# EAGLE design dumbpad (EAGLE 9.6.1)
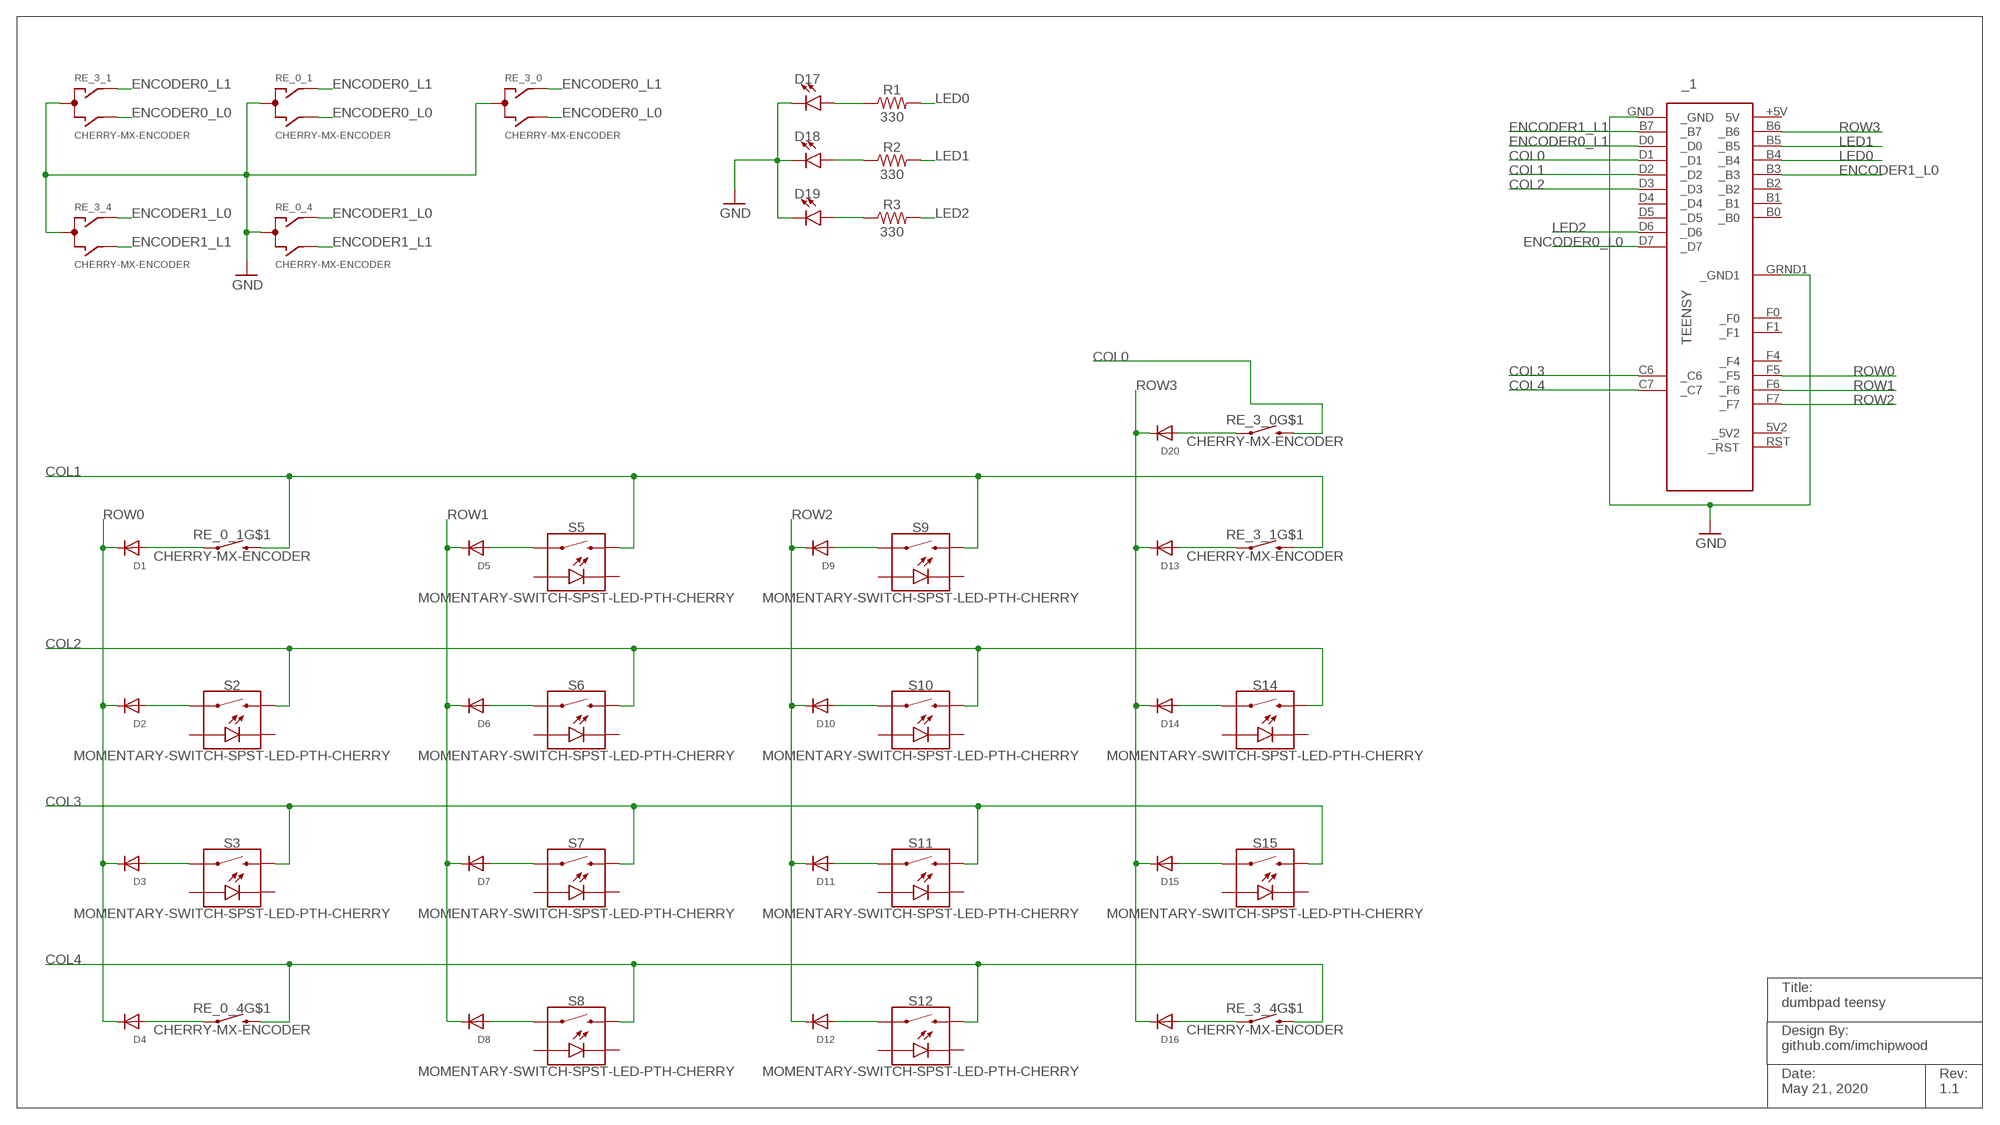
[diagram p0: schematic, sheet 1]

## Parts
_1  TEENSY  [TEENSY]
D1  DIODEDO-1N4148  [DO-1N4148]
D2  DIODEDO-1N4148  [DO-1N4148]
D3  DIODEDO-1N4148  [DO-1N4148]
D4  DIODEDO-1N4148  [DO-1N4148]
D5  DIODEDO-1N4148  [DO-1N4148]
D6  DIODEDO-1N4148  [DO-1N4148]
D7  DIODEDO-1N4148  [DO-1N4148]
D8  DIODEDO-1N4148  [DO-1N4148]
D9  DIODEDO-1N4148  [DO-1N4148]
D10  DIODEDO-1N4148  [DO-1N4148]
D11  DIODEDO-1N4148  [DO-1N4148]
D12  DIODEDO-1N4148  [DO-1N4148]
D13  DIODEDO-1N4148  [DO-1N4148]
D14  DIODEDO-1N4148  [DO-1N4148]
D15  DIODEDO-1N4148  [DO-1N4148]
D16  DIODEDO-1N4148  [DO-1N4148]
D17  LED3MM  [LED_3MM]
D18  LED3MM  [LED_3MM]
D19  LED3MM  [LED_3MM]
D20  DIODEDO-1N4148  [DO-1N4148]
R1  330  330OHM-HORIZ-1/10W-5%  [AXIAL-0.3]
R2  330  330OHM-HORIZ-1/10W-5%  [AXIAL-0.3]
R3  330  330OHM-HORIZ-1/10W-5%  [AXIAL-0.3]
RE_0_1  CHERRY-MX-ENCODER  [CHERRY-MX-ENCODER]
RE_0_4  CHERRY-MX-ENCODER  [CHERRY-MX-ENCODER]
RE_3_0  CHERRY-MX-ENCODER  [CHERRY-MX-ENCODER]
RE_3_1  CHERRY-MX-ENCODER  [CHERRY-MX-ENCODER]
RE_3_4  CHERRY-MX-ENCODER  [CHERRY-MX-ENCODER]
S2  MOMENTARY-SWITCH-SPST-LED-PTH-CHERRY  [CHERRY-MX-LED]
S3  MOMENTARY-SWITCH-SPST-LED-PTH-CHERRY  [CHERRY-MX-LED]
S5  MOMENTARY-SWITCH-SPST-LED-PTH-CHERRY  [CHERRY-MX-LED]
S6  MOMENTARY-SWITCH-SPST-LED-PTH-CHERRY  [CHERRY-MX-LED]
S7  MOMENTARY-SWITCH-SPST-LED-PTH-CHERRY  [CHERRY-MX-LED]
S8  MOMENTARY-SWITCH-SPST-LED-PTH-CHERRY  [CHERRY-MX-LED]
S9  MOMENTARY-SWITCH-SPST-LED-PTH-CHERRY  [CHERRY-MX-LED]
S10  MOMENTARY-SWITCH-SPST-LED-PTH-CHERRY  [CHERRY-MX-LED]
S11  MOMENTARY-SWITCH-SPST-LED-PTH-CHERRY  [CHERRY-MX-LED]
S12  MOMENTARY-SWITCH-SPST-LED-PTH-CHERRY  [CHERRY-MX-LED]
S14  MOMENTARY-SWITCH-SPST-LED-PTH-CHERRY  [CHERRY-MX-LED]
S15  MOMENTARY-SWITCH-SPST-LED-PTH-CHERRY  [CHERRY-MX-LED]

## Nets
COL0: _1.D1(_D1) RE_3_0.E RE_3_0.S2
COL1: _1.D2(_D2) RE_0_1.E RE_0_1.S2 RE_3_1.E RE_3_1.S2 S5.S2 S9.S2
COL2: _1.D3(_D3) S2.S2 S6.S2 S10.S2 S14.S2
COL3: _1.C6(_C6) S3.S2 S7.S2 S11.S2 S15.S2
COL4: _1.C7(_C7) RE_0_4.E RE_0_4.S2 RE_3_4.E RE_3_4.S2 S8.S2 S12.S2
ENCODER0_L0: _1.D7(_D7) RE_0_1.B RE_3_0.B RE_3_1.B
ENCODER0_L1: _1.D0(_D0) RE_0_1.A RE_3_0.A RE_3_1.A
ENCODER1_L0: _1.B3(_B3) RE_0_4.A RE_3_4.A
ENCODER1_L1: _1.B7(_B7) RE_0_4.B RE_3_4.B
GND: _1.GND(_GND) _1.GRND1(_GND1) D17.K(C) D18.K(C) D19.K(C) RE_0_1.C RE_0_4.C RE_3_0.C RE_3_1.C RE_3_4.C
LED0: _1.B4(_B4) R1.P$2
LED1: _1.B5(_B5) R2.P$2
LED2: _1.D6(_D6) R3.P$2
N$1: D4.A RE_0_4.D RE_0_4.S1
N$2: D3.A S3.S1
N$3: D2.A S2.S1
N$4: D1.A RE_0_1.D RE_0_1.S1
N$5: D17.A R1.P$1
N$6: D8.A S8.S1
N$7: D7.A S7.S1
N$8: D6.A S6.S1
N$9: D5.A S5.S1
N$10: D18.A R2.P$1
N$11: D16.A RE_3_4.D RE_3_4.S1
N$12: D15.A S15.S1
N$13: D14.A S14.S1
N$14: D13.A RE_3_1.D RE_3_1.S1
N$15: D19.A R3.P$1
N$16: D12.A S12.S1
N$17: D11.A S11.S1
N$18: D10.A S10.S1
N$19: D9.A S9.S1
N$20: D20.A RE_3_0.D RE_3_0.S1
ROW0: _1.F5(_F5) D1.C D2.C D3.C D4.C
ROW1: _1.F6(_F6) D5.C D6.C D7.C D8.C
ROW2: _1.F7(_F7) D9.C D10.C D11.C D12.C
ROW3: _1.B6(_B6) D13.C D14.C D15.C D16.C D20.C
Unconnected: _1.5V2(_5V2) _1.+5V(5V) _1.B0(_B0) _1.B1(_B1) _1.B2(_B2) _1.D4(_D4) _1.D5(_D5) _1.F0(_F0) _1.F1(_F1) _1.F4(_F4) _1.RST(_RST) S2.A S2.K(C) S3.A S3.K(C) S5.A S5.K(C) S6.A S6.K(C) S7.A S7.K(C) S8.A S8.K(C) S9.A S9.K(C) S10.A S10.K(C) S11.A S11.K(C) S12.A S12.K(C) S14.A S14.K(C) S15.A S15.K(C)

## Notes on the sheet
- Title:
  dumbpad teensy
- Design By:
  github.com/imchipwood
- Date:
  May 21, 2020
- Rev:
  1.1

## Library data of the parts
_1 = cpwood:TEENSY: Teensy 2.0
D1-D16 D20 = adafruit:DIODE: Diode SMADIODE - SMA Surface Mount Package 20V 1A Schottky Diode Digikey: 641-1014-6-ND DO-1N4148 - Through Hole Small Current Diode SOD-123 20V 1 A (.5mV Vf) Schottky Diode - Digikey: MBRX120TPMSCT-ND SOD-323 10V 570mA (.38mV Vf, 3ns) Schottky Diode - Digikey: ZLLS410CT-ND SOD-523 30V 30mA Schottky Diode (RB751S-40TE61) - Digikey: RB751S-40TE61CT-ND SOT23-R/W - SOT23 Package (R = Solder Paste/Reflow Ovens, W = Hand-Soldering) BAT54Film 40V 300mA - Digikey: 497-7162-1-ND
D17-D19 = SparkFun-LED:LED: LED (Generic) Standard schematic elements and footprints for 5mm, 3mm, 1206, and 0603 sized LEDs. Generic LEDs with no color specified.; PROD_ID: DIO-08794
R1-R3 = SparkFun-Resistors:330OHM: 330Ω resistor A resistor is a passive two-terminal electrical component that implements electrical resistance as a circuit element. Resistors act to reduce current flow, and, at the same time, act to lower voltage levels within circuits. - Wikipedia; PROD_ID: RES-8371
RE_0_1 RE_0_4 RE_3_0 RE_3_1 RE_3_4 = cpwood:CHERRY-MX-ENCODER
S2 S3 S5-S12 S14 S15 = SparkFun-Switches:MOMENTARY-SWITCH-SPST-LED: Momentary Switch (Pushbutton) - SPST - w/ LED Normally-open (NO) SPST momentary switches (buttons, pushbuttons), with a built-in LED. Variants PTH-CHERRY - Cherry MX Switch Cherry MX Keyswitches are top-of-the-line mechanical keyboard switches. They’re satisfyingly “clicky”, reliable up to tens-of-millions of key presses, and a standard in gaming and programming keyboards across the globe. This ‘blue’ version Cherry MX Switch is favored by most due to its secondary internal actuator making it less likely to “double-tap.” If you are looking for a noticeably audible and high-quality key switch, this is the perfect option for you! Cherry MX Switch <https://www.sparkfun.com/products/13834> (COM-13834) Cherry MX Switch Breakout <https://www.sparkfun.com/products/13773> (BOB-13773) PTH-12MM and PTH-12MM-KIT - 12mm Illuminated LED KIT variant is for soldering kits. There is no tStop (covering up the top side of the pads with mask). This helps the beginner see which side they should be soldering too. LED Tactile Button Breakout <https://www.sparkfun.com/products/10467> (BOB-10467) LED Tactile Button - Red <https://www.sparkfun.com/products/10442> (COM-10442) LED Tactile Button - Blue <https://www.sparkfun.com/products/10443> (COM-10443) LED Tactile Button - Green <https://www.sparkfun.com/products/10440> (COM-10440) LED Tactile Button - Orange <https://www.sparkfun.com/products/10441> (COM-10441) LED Tactile Button - White <https://www.sparkfun.com/products/10439> (COM-10439); SF_ID: COM-13834

## Board
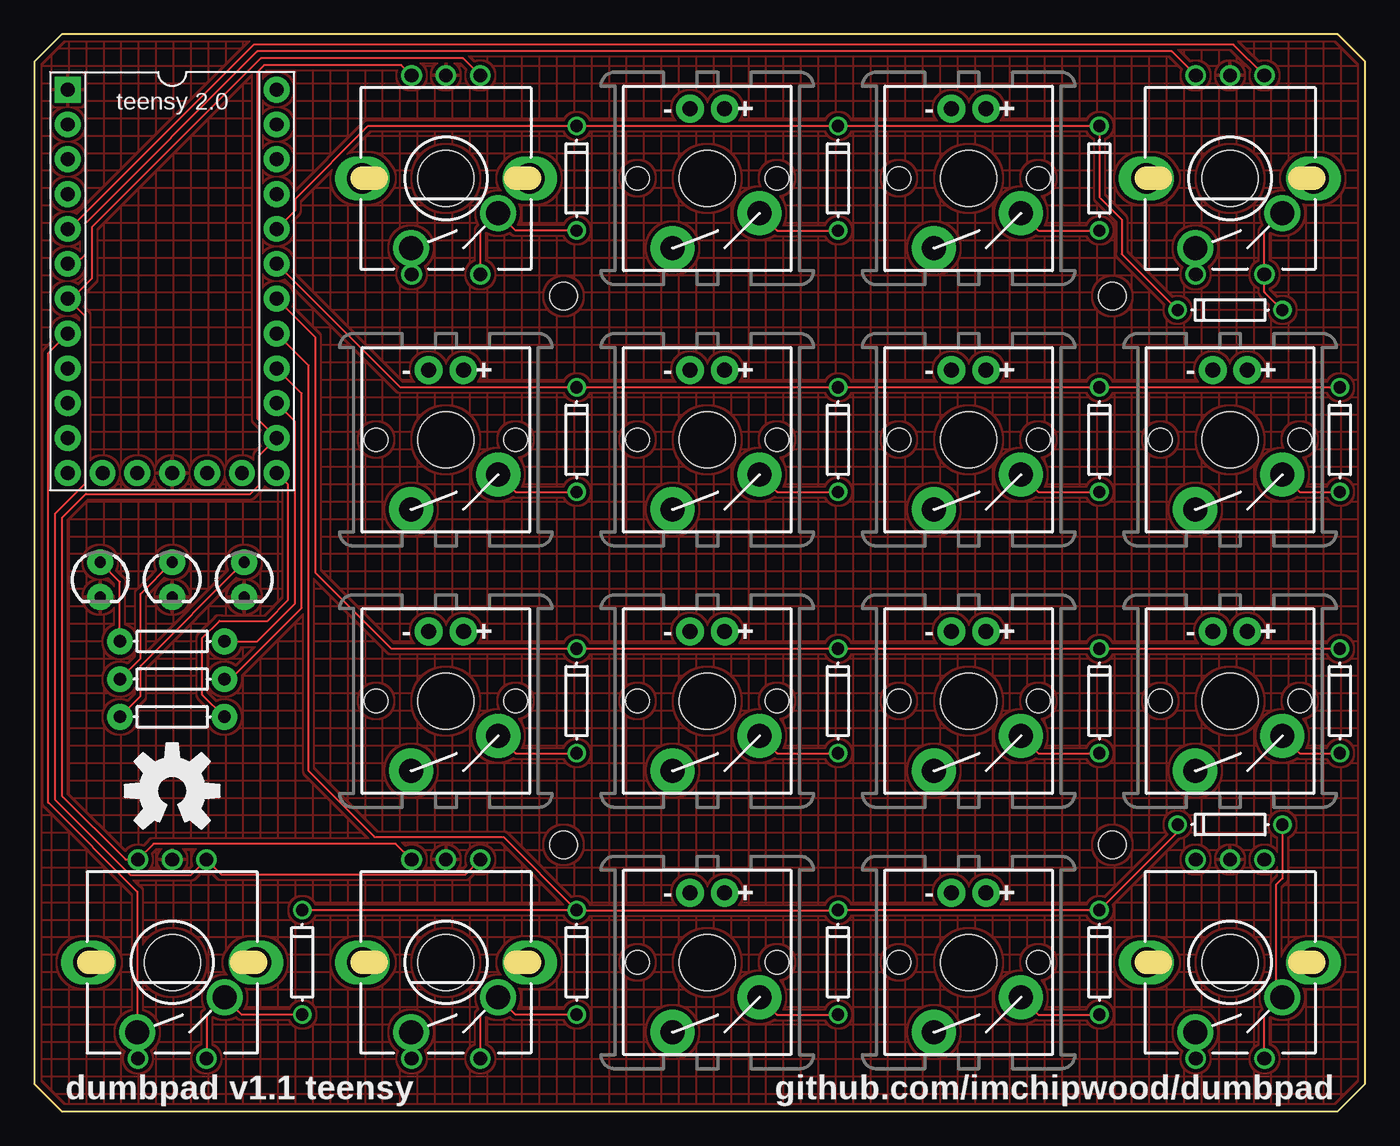
[diagram p1: board, top side]
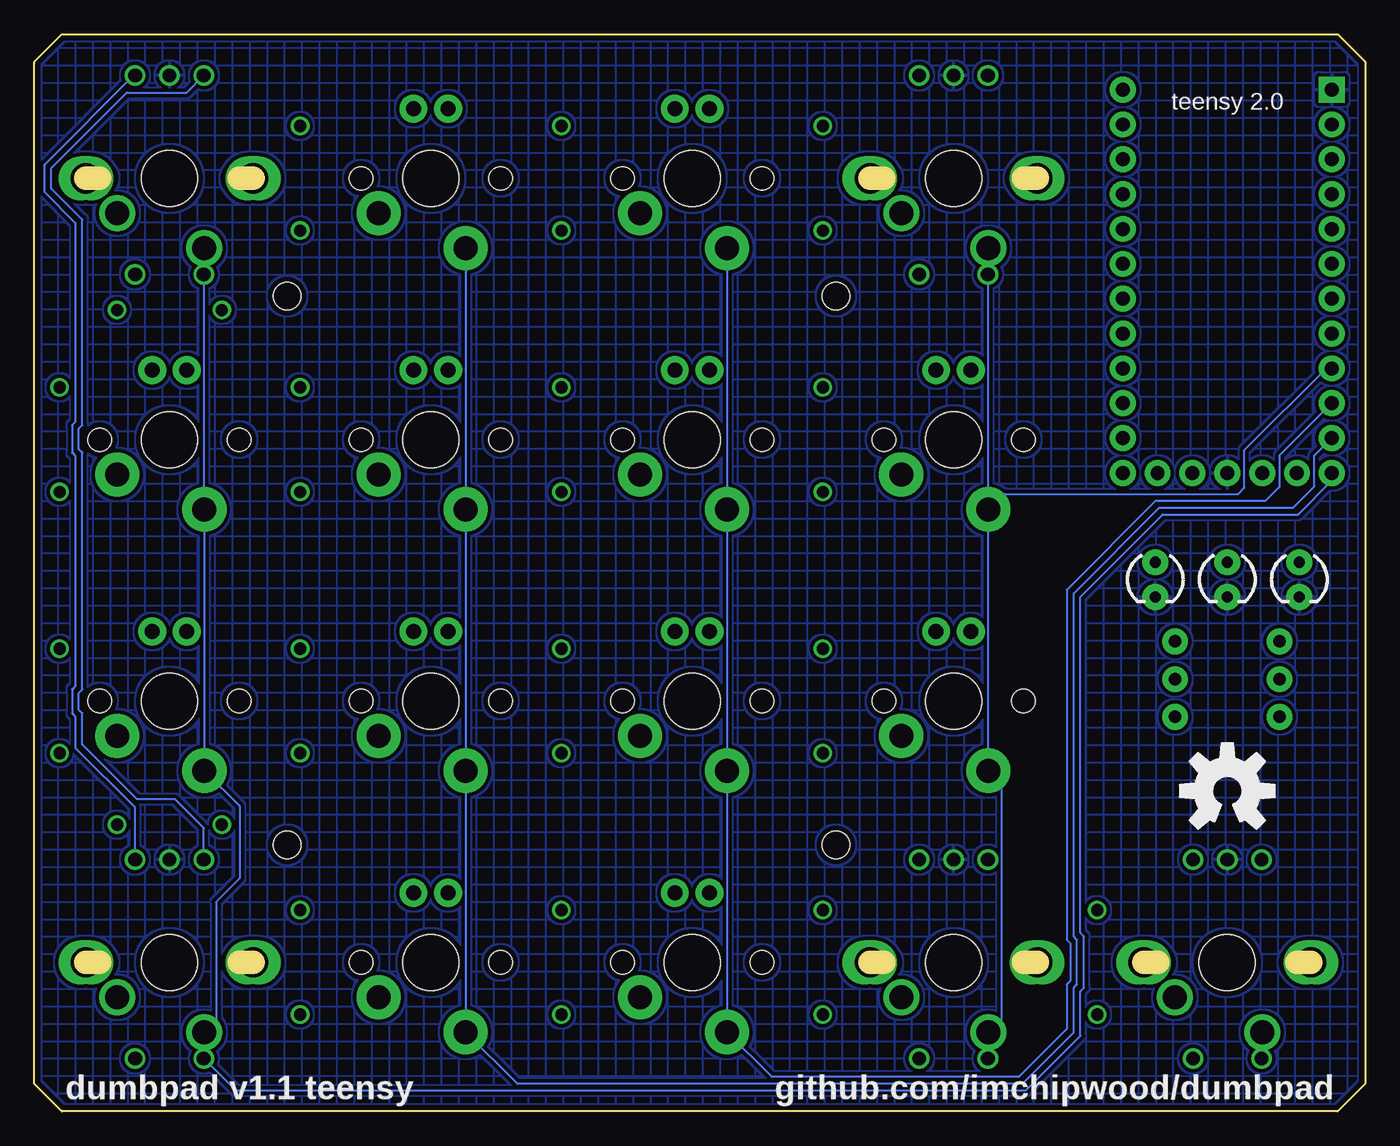
[diagram p2: board, bottom side, seen from below]

Size 97 x 78.5 mm. Coordinates in mm from the lower left corner, seen from the top.
Outline: 0,2 2,0 95,0 97,2 97,76.5 95,78.5 2,78.5 0,76.5 0,2
Copper layers (1*16): Top 0.035559375mm / dielectric 1.6mm / Bottom 0.035559375mm
Design rules "oshpark-2layer *": minimum track width 6mil, minimum drill 10mil, track to track 6mil, track to pad 6mil, pad to pad 6mil, via to via 6mil, smd to smd 6mil, copper to edge 15mil, drill to drill 6mil, minimum pad ring 5mil, minimum via ring 5mil, stop-mask expansion 2.5mil, vias tented up to drill 0mil, thermal gap 10mil
Holes 2 mm at 38.58,59.42 38.58,19.43 78.58,19.43 78.58,59.42

### Footprints (pad centres in the part's own frame; a part is rotated, then mirrored left to right if it is on the bottom)
TEENSY = drill 1.016 pad 1.88: 5V2 13.97,-2.54; +5V -13.97,7.62; B0 -11.43,-7.62; B1 -8.89,-7.62; B2 -6.35,-7.62; B3 -3.81,-7.62; B4 8.89,7.62; B5 6.35,7.62; B6 3.81,7.62; B7 -1.27,-7.62; C6 11.43,-7.62; C7 13.97,-7.62; D0 1.27,-7.62; D1 3.81,-7.62; D2 6.35,-7.62; D3 8.89,-7.62; D4 13.97,5.08; D5 13.97,-5.08; D6 13.97,7.62; D7 11.43,7.62; F0 -11.43,7.62; F1 -8.89,7.62; F4 -6.35,7.62; F5 -3.81,7.62; F6 -1.27,7.62; F7 1.27,7.62; GRND1 13.97,0; RST 13.97,2.54 | drill 1.016 pad 1.88 square: GND -13.97,-7.62
DO-1N4148 = drill 0.9: A -3.81,0; C 3.81,0
LED_3MM = drill 0.813 pad 1.88: A -1.27,0; K 1.27,0
AXIAL-0.3 = drill 0.9 pad 1.88: P$1 -3.81,0; P$2 3.81,0
CHERRY-MX-ENCODER = drill 1: A 2.5,7.5; B -2.5,7.5; C 0,7.5; D 2.5,-7; E -2.5,-7 | drill 2.2 pad 2.54 long: CASE1 -6.1,0; CASE2 6.1,0 | drill 1.753 pad 2.286: S1 3.81,-2.54; S2 -2.54,-5.08 | hole 4.089: 0,0
CHERRY-MX-LED = drill 1.092 pad 2.032: A -1.27,-5.08; K 1.27,-5.08 | drill 1.753 pad 3.226: S1 -3.81,2.54; S2 2.54,5.08 | hole 4.089: 0,0 | hole 1.707: -5.08,0; 5.08,0

### Placement (x,y rotation side)
_1  10.05,60.5 270 top
D1  39.52,68 90 top
D2  58.58,68 90 top
D3  77.62,68 90 top
D4  87.15,58.4 180 top
D5  39.52,48.95 90 top
D6  58.58,48.95 90 top
D7  77.62,48.95 90 top
D8  95.15,48.95 90 top
D9  39.52,29.9 90 top
D10  58.58,29.9 90 top
D11  77.62,29.9 90 top
D12  95.15,29.9 90 top
D13  39.52,10.85 90 top
D14  58.58,10.85 90 top
D15  77.62,10.85 90 top
D16  87.15,20.9 180 top
D17  4.8,38.75 270 top
D18  10.05,38.75 270 top
D19  15.3,38.75 270 top
D20  19.52,10.85 90 top
LOGO1  OSHW-LOGOL  [OSHW-LOGO-L]  10.05,23.35 0 bottom
LOGO2  OSHW-LOGOL  [OSHW-LOGO-L]  10.05,23.35 0 top
R1  10.05,34.25 0 top
R2  10.05,31.5 0 top
R3  10.05,28.75 0 top
RE_0_1  30,68 0 top
RE_0_4  87.15,68 0 top
RE_3_0  10.05,10.85 0 top
RE_3_1  30,10.85 0 top
RE_3_4  87.15,10.85 0 top
S2  49.05,68 180 top
S3  68.1,68 180 top
S5  30,48.95 180 top
S6  49.05,48.95 180 top
S7  68.1,48.95 180 top
S8  87.15,48.95 180 top
S9  30,29.9 180 top
S10  49.05,29.9 180 top
S11  68.1,29.9 180 top
S12  87.15,29.9 180 top
S14  49.05,10.85 180 top
S15  68.1,10.85 180 top

### Tracks (layer width: path | path; a pad name or v marks a point on that pad's centre or on a via)
COL0
  Top 0.152: RE_3_0.E 7.55,5.77 RE_3_0.S2 7.5,16 1,22.5 1,55.26 _1.D1
COL1
  Bottom 0.152: RE_3_1.E 27.5,5.73 RE_3_1.S2 26.5,6.73 26.5,23.86 S9.S2 S5.S2 | RE_0_1.S2 27.46,61.04 RE_0_1.E 27.46,60.96 S5.S2 | _1.D2 2.85,54.15 8.8,48.2 8.8,45.45 9.25,45 26.33,45 S5.S2
COL2
  Bottom 0.152: S2.S2 S6.S2 S10.S2 S14.S2 43.24,2.5 25.25,2.5 21.75,6 21.75,9.25 21.5,9.5 21.5,12.25 21.75,12.5 21.75,38 15.25,44.5 7.25,44.5 6.25,45.5 6.25,47.79 _1.D3
COL3
  Bottom 0.152: S3.S2 S7.S2 S11.S2 S15.S2 61.79,2 25,2 21.25,5.75 21.25,9 21,9.25 21,12.5 21.25,12.75 21.25,37.75 15,44 5.25,44 3.7,45.55 3.7,47.8 _1.C6
COL4
  Bottom 0.152: RE_0_4.S2 84.65,62.88 RE_0_4.E 84.61,60.96 S8.S2 S12.S2 82,22.21 82,17 83.75,15.25 83.75,6.63 RE_3_4.S2 84.61,3.89 RE_3_4.E 82.3,1.5 24.75,1.5 20.75,5.5 20.75,8.75 20.5,9 20.5,12.75 20.75,13 20.75,37.5 14.75,43.5 4.89,43.5 2.43,45.96 _1.C7
ENCODER0_L0
  Top 0.152: RE_3_1.B 26.35,19.5 8.7,19.5 RE_3_0.B 6.65,18.35 2,23 2,43.25 3.75,45 15.75,45 16.4,45.65 16.4,47.8 _1.D7 16.25,50.49 16.25,75.75 16.75,76.25 26.75,76.25 RE_0_1.B
ENCODER0_L1
  Top 0.152: RE_3_1.A 31.4,17.25 13.65,17.25 RE_3_0.A 11.45,17.25 7,17.25 1.5,22.75 1.5,43.55 3.7,45.75 3.7,57.96 _1.D0 2.73,59.23 4.2,60.7 4.2,64.45 16.5,76.75 31.25,76.75 RE_0_1.A
ENCODER1_L0
  Top 0.152: RE_0_4.A 87.4,77.75 16,77.75 2.56,64.31 _1.B3
  Bottom 0.152: RE_3_4.A 89.65,22.15 94,26.5 94,28.75 94.25,29 94.25,30.75 94,31 94,47.75 94.25,48 94.25,50 94,50.25 94,64.75 96.25,67 96.25,69 89.75,75.5 RE_0_4.A
ENCODER1_L1
  Top 0.152: RE_0_4.B 82.9,77.25 16.25,77.25 3.7,64.7 3.7,62.45 3.02,61.77 _1.B7
  Bottom 0.152: RE_3_4.B 84.65,20.65 86.75,22.75 89.5,22.75 93.5,26.75 93.5,29 93.75,29.25 93.75,30.5 93.5,30.75 93.5,48 93.75,48.25 93.75,49.75 93.5,50 93.5,65 95.75,67.25 95.75,68.75 90.25,74.25 85.9,74.25 RE_0_4.B
GND
  pour Top (isolate 0.254, hatched): 0,2 2,0 95,0 97,2 97,76.5 95,78.5 2,78.5 0,76.5
  pour Bottom (isolate 0.254, hatched): 0,2 2,0 95,0 97,2 97,76.5 95,78.5 2,78.5 0,76.5
LED0
  Top 0.152: R1.P$2 16.25,34.25 19,37 19,50.28 _1.B4
LED1
  Top 0.152: R2.P$2 14.31,31.5 19.5,36.69 19.5,52.32 _1.B5
LED2
  Top 0.152: R3.P$2 12.25,30.36 12.25,34.5 13.5,35.75 17,35.75 18.5,37.25 18.5,45.7 _1.D6
N$1
  Top 0.152: D4.A 89.65,59.71 RE_0_4.D 89.65,64.15 RE_0_4.S1
N$2
  Top 0.152: S3.S1 73.18,64.19 D3.A
N$3
  Top 0.152: S2.S1 54.13,64.19 D2.A
N$4
  Top 0.152: D1.A 35.08,64.19 RE_0_1.S1 32.5,64.15 RE_0_1.D
N$5
  Top 0.152: R1.P$1 6.24,38.58 D17.A
N$6
  Top 0.152: S8.S1 92.23,45.14 D8.A
N$7
  Top 0.152: S7.S1 73.18,45.14 D7.A
N$8
  Top 0.152: S6.S1 54.13,45.14 D6.A
N$9
  Top 0.152: S5.S1 35.08,45.14 D5.A
N$10
  Top 0.152: R2.P$1 7.75,33.01 7.75,37.72 D18.A
N$11
  Top 0.152: D16.A 90.96,16.96 90.5,16.5 90.5,8.77 RE_3_4.S1 89.65,7 RE_3_4.D
N$12
  Top 0.152: S15.S1 73.18,7.04 D15.A
N$13
  Top 0.152: S14.S1 54.13,7.04 D14.A
N$14
  Top 0.152: D13.A 35.08,7.04 RE_3_1.S1 32.5,7 RE_3_1.D
N$15
  Top 0.152: R3.P$1 7.75,30.26 7.75,32.47 D19.A
N$16
  Top 0.152: S12.S1 92.23,26.09 D12.A
N$17
  Top 0.152: S11.S1 73.18,26.09 D11.A
N$18
  Top 0.152: S10.S1 54.13,26.09 D10.A
N$19
  Top 0.152: S9.S1 35.08,26.09 D9.A
N$20
  Top 0.152: D20.A 15.13,7.04 RE_3_0.S1 12.55,7 RE_3_0.D
ROW0
  Top 0.152: D4.C 79.25,62.49 79.25,65 77.62,66.62 D3.C D2.C D1.C 24.31,71.81 19,66.5 19,65.64 _1.F5
ROW1
  Top 0.152: D8.C D7.C D6.C D5.C 26.68,52.76 _1.F6
ROW2
  Top 0.152: D12.C D11.C D10.C D9.C 26.04,33.71 20.5,39.25 20.5,56.4 _1.F7
ROW3
  Top 0.152: D16.C 83.34,20.38 D15.C D14.C D13.C | D13.C D20.C | D13.C 34.19,20 24.8,20 20,24.8 20,54.36 _1.B6

### Text on the board
tNames: teensy 2.0 | dumbpad v1.1 teensy | github.com/imchipwood/dumbpad
bNames: teensy 2.0 | github.com/imchipwood/dumbpad | dumbpad v1.1 teensy